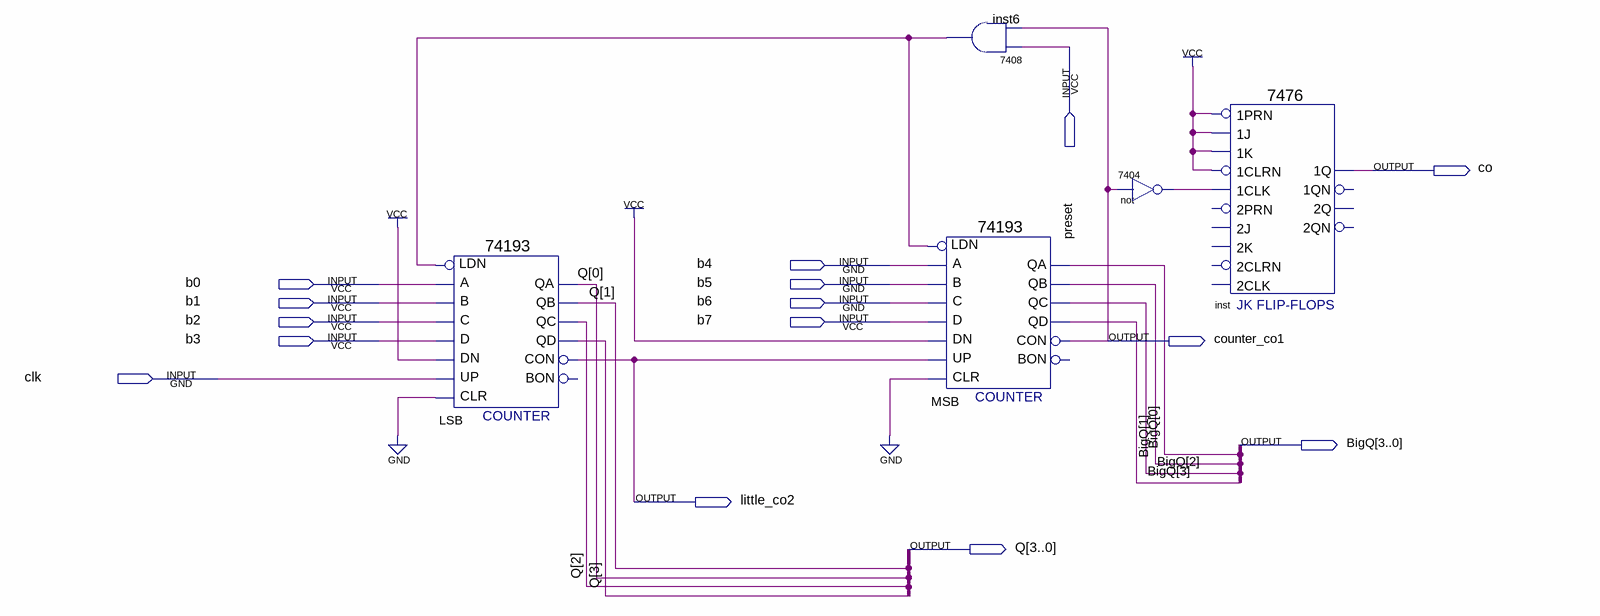
[diagram p0: schematic sheet]
// Quartus schematic Counter.bdf as structural Verilog: 5 symbols, 15 pins
module Counter (
  input  preset,
  input  b4,
  input  b0,
  input  b5,
  input  b1,
  input  b6,
  input  b2,
  input  b7,
  input  b3,
  input  clk,
  output co,
  output counter_co1,
  output [3:0] BigQ,
  output little_co2,
  output [3:0] Q
);

  wire inst6_1, not_1;

  \74193  LSB (
    .D(b3), .C(b2), .B(b1), .A(b0), .CLR(1'b0), .UP(clk), .DN(1'b1), .LDN(inst6_1), .QB(Q[1]), .QA(Q[0]),
    .CON(little_co2), .QD(Q[3]), .QC(Q[2]));  // open: BON
  \74193  MSB (
    .D(b7), .C(b6), .B(b5), .A(b4), .CLR(1'b0), .UP(little_co2), .DN(1'b1), .LDN(inst6_1), .QB(BigQ[1]),
    .QA(BigQ[0]), .CON(counter_co1), .QD(BigQ[3]), .QC(BigQ[2]));  // open: BON
  \7408  inst6 (.\3 (counter_co1), .\2 (preset), .\1 (inst6_1));
  \7404  \not  (.\2 (counter_co1), .\1 (not_1));
  \7476  inst (
    .\1J (1'b1), .\1K (1'b1), .\1PRN (1'b1), .\1CLK (not_1), .\1CLRN (1'b1), .\1Q (co));  // open: 2PRN, 2J, 2K, 2CLRN, 2CLK, 2QN, 2Q, 1QN
endmodule
